# Altium schematic sheet Sheet3.SchDoc
size A4
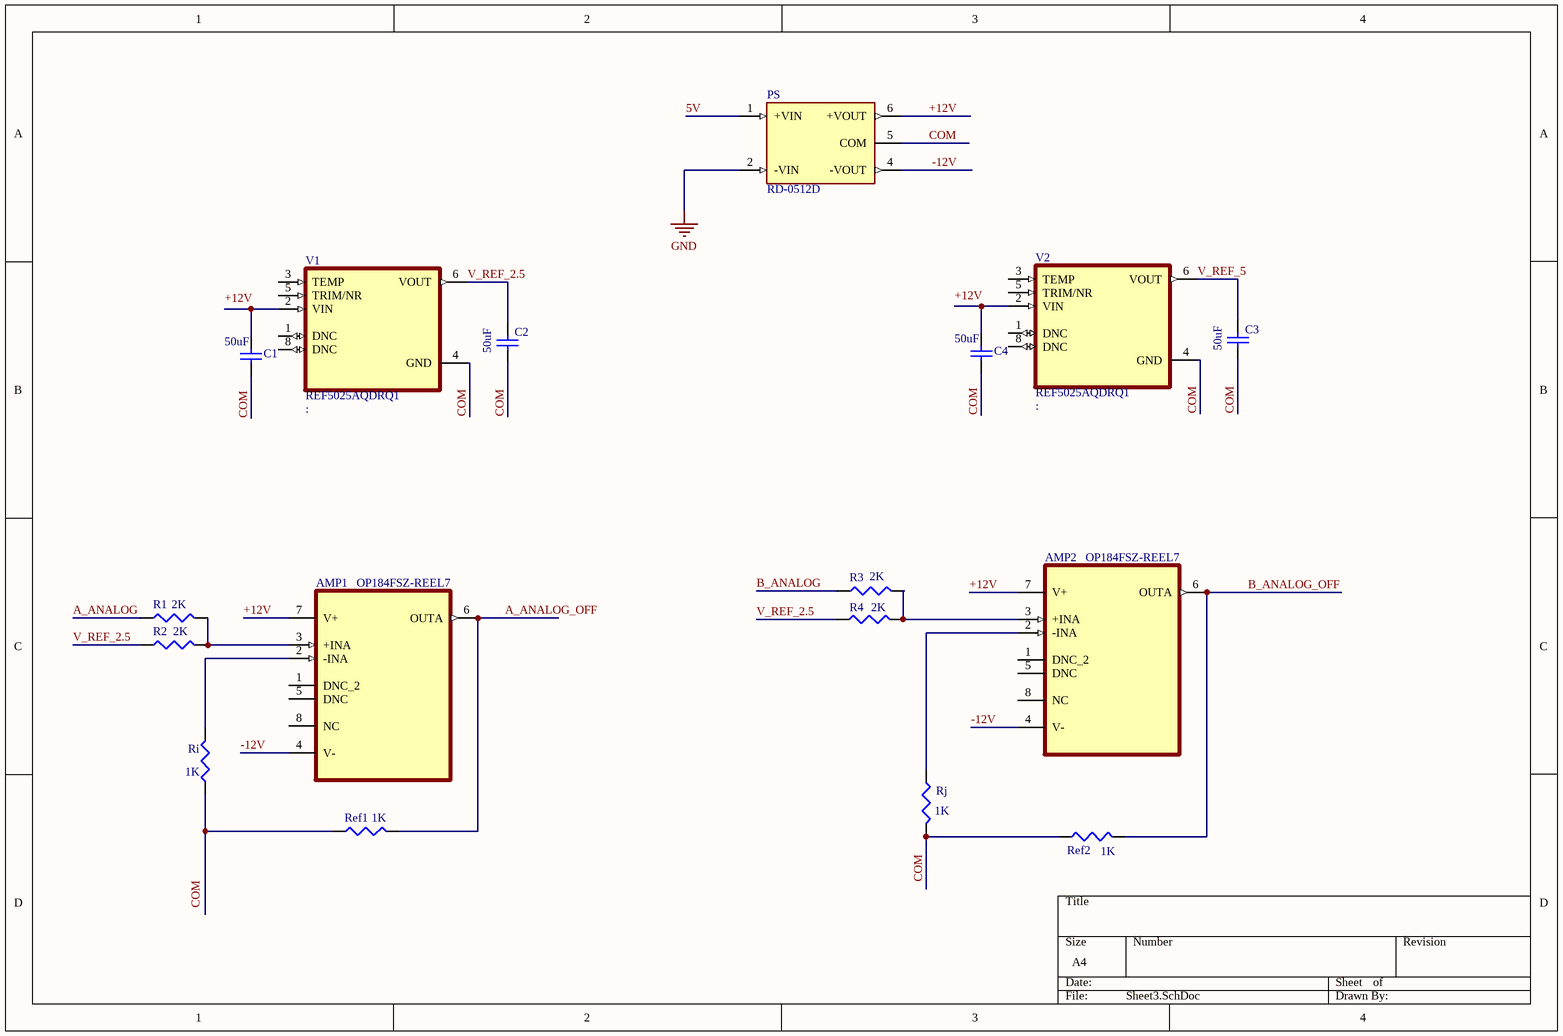
[diagram p0: Sheet3.SchDoc]

## Parts
AMP1  OP184FSZ-REEL7  [SOIC127P600X175-8N]
AMP2  OP184FSZ-REEL7  [SOIC127P600X175-8N]
C1  value 50uF  [0402]
C2  value 50uF  [0402]
C3  value 50uF  [0402]
C4  value 50uF  [0402]
PS  RD-0512D  [CONV_RD-0512D]
R1  value 2K  [J1-0603]  (hidden comment: Res3)
R2  value 2K  [J1-0603]  (hidden comment: Res3)
R3  value 2K  [J1-0603]
R4  value 2K  [J1-0603]  (hidden comment: Res3)
Ref1  value 1K  [J1-0603]  (hidden comment: Res3)
Ref2  value 1K  [J1-0603]  (hidden comment: Res3)
Ri  value 1K  [J1-0603]  (hidden comment: Res3)
Rj  value 1K  [J1-0603]  (hidden comment: Res3)
V1  REF5025AQDRQ1  [SOIC127P599X175-8N]
V2  REF5025AQDRQ1  [SOIC127P599X175-8N]

## Nets
GND: PS.2(-VIN)
5V: PS.1(+VIN)
+12V: AMP1.7(V+) AMP2.7(V+) PS.6(+VOUT)
-12V: AMP1.4(V-) AMP2.4(V-) PS.4(-VOUT)
A_ANALOG: R1.1
A_ANALOG_OFF: AMP1.6(OUTA) Ref1.2
B_ANALOG: R3.1
B_ANALOG_OFF: AMP2.6(OUTA) Ref2.2
COM: C1.1 C2.1 C3.1 C4.1 PS.5(COM) Ref2.1 Rj.2 V1.4(GND) V2.4(GND)
V_REF_2.5: C2.2 R2.1 R4.1 V1.6(VOUT)
V_REF_5: C3.2 V2.6(VOUT)
NetAMP1_2: AMP1.2(-INA) Ri.2
NetAMP1_3: AMP1.3(+INA) R1.2 R2.2
NetAMP2_2: AMP2.2(-INA) Rj.1
NetAMP2_3: AMP2.3(+INA) R3.2 R4.2
NetC1_2: C1.2 V1.2(VIN)
NetC4_2: C4.2 V2.2(VIN)
NetRef1_1: Ref1.1 Ri.1

Not connected (* = marked no-connect by the designer): AMP1 1(DNC_2) 5(DNC) 8(NC); AMP2 1(DNC_2) 5(DNC) 8(NC); V1 1(DNC) 3(TEMP) 5(TRIM/NR) 8(DNC); V2 1(DNC) 3(TEMP) 5(TRIM/NR) 8(DNC)

## Notes on the sheet
- Labels drawn without touching a wire or pin: +12V, COM

## Library data of the parts
AMP1 AMP2 = OP184FSZ-REEL7: General Purpose Amplifier 1 Circuit Rail-to-Rail 8-SOIC; MF: Analog Devices; Value: *; Purchase-URL: https://pricing.snapeda.com/search/part/OP184FSZ-REEL7/?ref=eda; Package: SOIC-8 Analog Devices; MP: OP184FSZ-REEL7; Check_prices: https://www.snapeda.com/parts/OP184FSZ-REEL7/Analog%20Devices%20Inc./view-part/1221640/?ref=eda; SnapEDA_Link: https://www.snapeda.com/parts/OP184FSZ-REEL7/Analog%20Devices%20Inc./view-part/1221640/?ref=snap; Digi-Key_Part_Number: OP184FSZ-REEL7CT-ND
C1-C4 = Cap Semi: Capacitor (Semiconductor SIM Model); Published: 8-Jun-2000; LatestRevisionDate: 29-May-2009; LatestRevisionNote: IPC-7351 Footprint Added.; PackageReference: C1206; Publisher: Altium Limited; PackageDescription: Chip Capacitor
PS = RD-0512D: 2W DC/DC-Converter 'ECONOLINE' SIP7 1kV unreg; MF: Recom Power; Digi-Key_Purchase_URL: https://www.digikey.com/product-detail/en/recom-power/RD-0512D-P/945-1821-5-ND/2303656?utm_source=snapeda&utm_medium=aggregator&utm_campaign=symbol; Digi-Key_Part_Number: 945-1821-5-ND; Package: SIP-7 Recom Power; Value: *; MP: RD-0512D; SnapEDA_Link: https://www.snapeda.com/parts/RD-0512D/Recom%20Power/view-part/3631333/?ref=snap
R1-R4 Ref1 Ref2 Ri Rj = Res3: Resistor; Published: 8-Jun-2000; LatestRevisionDate: 29-May-2009; LatestRevisionNote: IPC-7351 Footprint Added.; PackageReference: J1-0603; Publisher: Altium Limited; PackageDescription: Chip Resistor
V1 V2 = REF5025AQDRQ1: Automotive, low-noise, very-low drift, precision 2.5-V series voltage reference 8-SOIC -40 to 125; MF: Texas Instruments; MP: REF5025AQDRQ1; Purchase-URL: https://pricing.snapeda.com/search/part/REF5025AQDRQ1/?ref=eda; SnapEDA_Link: https://www.snapeda.com/parts/REF5025AQDRQ1/Texas%20Instruments/view-part/559984/?ref=snap; Availability: Warning; Package: SOIC-8 Texas Instruments; Value: *; Price: None